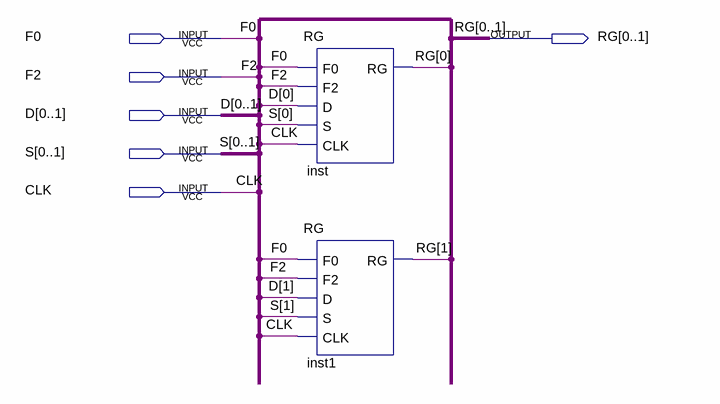
[diagram p0: schematic sheet]
// Quartus schematic RG2.bdf as structural Verilog: 2 symbols, 6 pins
module RG2 (
  input  F0,
  input  F2,
  input  [0:1] D,
  input  [0:1] S,
  input  CLK,
  output [0:1] RG
);

  RG inst (.F0(F0), .F2(F2), .D(D[0]), .S(S[0]), .CLK(CLK), .RG(RG[0]));
  RG inst1 (.F0(F0), .F2(F2), .D(D[1]), .S(S[1]), .CLK(CLK), .RG(RG[1]));
endmodule
